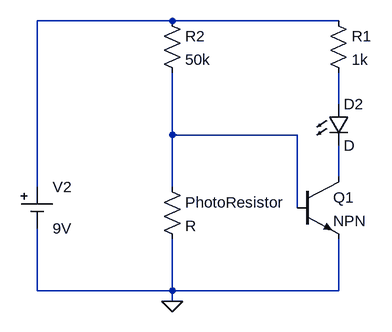
[diagram p0: schematic ek3CyborgVer1.asc]
ek3CyborgVer1.asc, the LTspice schematic file:
Version 4
SHEET 1 880 680
WIRE 240 -144 32 -144
WIRE 496 -144 240 -144
WIRE 496 -16 496 -64
WIRE 240 32 240 -64
WIRE 432 32 240 32
WIRE 496 96 496 48
WIRE 32 112 32 -144
WIRE 240 112 240 32
WIRE 432 144 432 32
WIRE 32 272 32 176
WIRE 240 272 240 192
WIRE 240 272 32 272
WIRE 496 272 496 192
WIRE 496 272 240 272
WIRE 240 288 240 272
FLAG 240 288 0
SYMBOL npn3 432 96 R0
SYMATTR InstName Q1
SYMBOL res 480 -160 R0
SYMATTR InstName R1
SYMATTR Value 1k
SYMBOL res 224 -160 R0
SYMATTR InstName R2
SYMATTR Value 50k
SYMBOL LED 480 -16 R0
SYMATTR InstName D2
SYMBOL Misc\\cell 32 112 R0
WINDOW 123 0 0 Left 0
WINDOW 39 0 0 Left 0
SYMATTR InstName V2
SYMATTR Value 9V
SYMBOL res 224 96 R0
SYMATTR InstName PhotoResistor

The netlist it stands for:
* ek3CyborgVer1.asc
Q1 N004 N003 0 0 NPN
R1 N001 N002 1k
R2 N001 N003 50k
D2 N002 N004 D
V2 N001 0 9V
R§PhotoResistor N003 0 R
.model D D
.lib standard.dio
.model NPN NPN
.model PNP PNP
.lib standard.bjt
.backanno
.end